# Altium project RecepteurTelecommande.PrjPcb
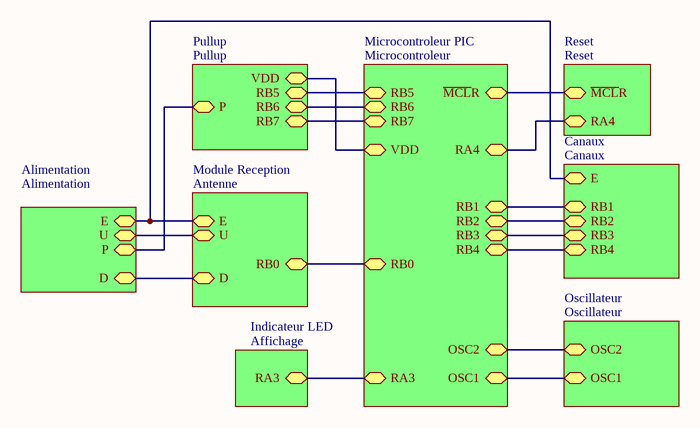
[diagram p0: Recepteur.SchDoc]
9 sheets, 36 parts. Net scope: hierarchical (ports join the sheet entries above them; power ports are global).
Board file: Recepteur.PcbDoc
Sheets:
  Recepteur.SchDoc
    Canaux = Canaux.SchDoc
    Reset = Reset.SchDoc
    Oscillateur = Oscillateur.SchDoc
    Alimentation = Alimentation.SchDoc
    Module Reception = Antenne.SchDoc
    Indicateur LED = Affichage.SchDoc
    Microcontroleur PIC = Microcontroleur.SchDoc
    Pullup = Pullup.SchDoc

## Sheet Recepteur.SchDoc
size A4

### Sub-sheets
Alimentation = Alimentation: E, U, D, P
Canaux = Canaux: RB1, RB2, RB3, RB4, E
Indicateur LED = Affichage: RA3
Microcontroleur PIC = Microcontroleur: RB5, RB6, RB7, RB0, RA3, OSC1, OSC2, RB4, RB3, RB2, RB1, ~{MCL}R, VDD, RA4
Module Reception = Antenne: RB0, D, U, E
Oscillateur = Oscillateur: OSC2, OSC1
Pullup = Pullup: RB5, RB6, RB7, P, VDD
Reset = Reset: ~{MCL}R, RA4

### Nets
NetC1_1: sheet Reset/RA4, sheet Alimentation/U, sheet Alimentation/P, sheet Module Reception/U, sheet Microcontroleur PIC/VDD, sheet Microcontroleur PIC/RA4, sheet Pullup/P, sheet Pullup/VDD
NetC3_1: sheet Canaux/E, sheet Alimentation/E, sheet Module Reception/E
NetC4_2: sheet Oscillateur/OSC2, sheet Microcontroleur PIC/OSC2
NetC5_2: sheet Oscillateur/OSC1, sheet Microcontroleur PIC/OSC1
NetD2_1: sheet Alimentation/D, sheet Module Reception/RB0, sheet Module Reception/D, sheet Microcontroleur PIC/RB0
NetLD1_1: sheet Indicateur LED/RA3, sheet Microcontroleur PIC/RA3
NetR2_1: sheet Microcontroleur PIC/RB5, sheet Pullup/RB5
NetR3_1: sheet Microcontroleur PIC/RB6, sheet Pullup/RB6
NetR4_1: sheet Microcontroleur PIC/RB7, sheet Pullup/RB7
NetR7_2: sheet Reset/~{MCL}R, sheet Microcontroleur PIC/~{MCL}R
NetU3_7: sheet Canaux/RB1, sheet Microcontroleur PIC/RB1
NetU3_8: sheet Canaux/RB2, sheet Microcontroleur PIC/RB2
NetU3_9: sheet Canaux/RB3, sheet Microcontroleur PIC/RB3
NetU3_10: sheet Canaux/RB4, sheet Microcontroleur PIC/RB4

## Sheet Canaux.SchDoc
size A
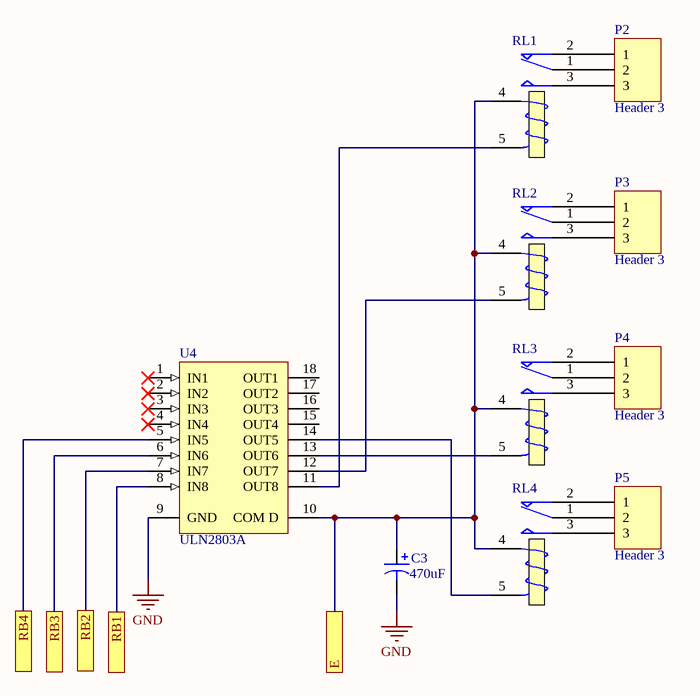
[diagram p1: Canaux.SchDoc]

### Parts
C3  value 470uF  [RB7.6-15]  (hidden comment: Cap Pol1)
P2  Header 3  [HDR1X3]
P3  Header 3  [HDR1X3]
P4  Header 3  [HDR1X3]
P5  Header 3  [HDR1X3]
RL1  Relay  [MODULE5B]  (value not drawn)
RL2  Relay  [MODULE5B]  (value not drawn)
RL3  Relay  [MODULE5B]  (value not drawn)
RL4  Relay  [MODULE5B]  (value not drawn)
U4  ULN2803A  [A18]

### Ports
E, RB1, RB2, RB3, RB4

### Nets
GND: C3.2 U4.9(GND)
NetC3_1: C3.1 RL1.4(T1) RL2.4(T1) RL3.4(T1) RL4.4(T1) U4.10(COM_D) ; port E
NetP2_1: P2.1 RL1.2(NC)
NetP2_2: P2.2 RL1.1(COM)
NetP2_3: P2.3 RL1.3(NO)
NetP3_1: P3.1 RL2.2(NC)
NetP3_2: P3.2 RL2.1(COM)
NetP3_3: P3.3 RL2.3(NO)
NetP4_1: P4.1 RL3.2(NC)
NetP4_2: P4.2 RL3.1(COM)
NetP4_3: P4.3 RL3.3(NO)
NetP5_1: P5.1 RL4.2(NC)
NetP5_2: P5.2 RL4.1(COM)
NetP5_3: P5.3 RL4.3(NO)
NetRL1_5: RL1.5(T2) U4.11(OUT8)
NetRL2_5: RL2.5(T2) U4.12(OUT7)
NetRL3_5: RL3.5(T2) U4.13(OUT6)
NetRL4_5: RL4.5(T2) U4.14(OUT5)
NetU3_7: U4.8(IN8) ; port RB1
NetU3_8: U4.7(IN7) ; port RB2
NetU3_9: U4.6(IN6) ; port RB3
NetU3_10: U4.5(IN5) ; port RB4

Not connected (* = marked no-connect by the designer): U4 1(IN1)* 2(IN2)* 3(IN3)* 4(IN4)* 15(OUT4) 16(OUT3) 17(OUT2) 18(OUT1)

### Library data of the parts
C3 = Cap Pol1: Polarized Capacitor (Radial); Published: 8-Jun-2000; LatestRevisionDate: 17-Jul-2002; LatestRevisionNote: Re-released for DXP Platform.; PackageReference: RB7.6-15; Publisher: Altium Limited; PackageDescription: Polarized Capacitor (Radial); 2 Leads
P2-P5 = Header 3: Header, 3-Pin; LatestRevisionDate: 17-Jul-2002; LatestRevisionNote: Re-released for DXP Platform.; Publisher: Altium Limited
RL1-RL4 = Relay: SPDT Relay; Published: 8-Jun-2000; LatestRevisionDate: 17-Jul-2002; LatestRevisionNote: Re-released for DXP Platform.; PackageReference: MODULE5B; Publisher: Altium Limited
U4 = ULN2803A: High-Voltage, High-Current Darlington Array; Published: 13-Oct-2000; LatestRevisionDate: 06-Jun-2005; LatestRevisionNote: Stylized 3D Model Added.; DatasheetVersion: 1999; PackageVersion: 1999; PackageReference: A18; Publisher: Altium Limited; PackageDescription: DIP; 18 Leads; Row Spacing 7.62 mm; Pitch 2.54 mm; ComponentLink1Description: Manufacturer Link; ComponentLink1URL: http://www.allegromicro.com/

## Sheet Reset.SchDoc
size A4
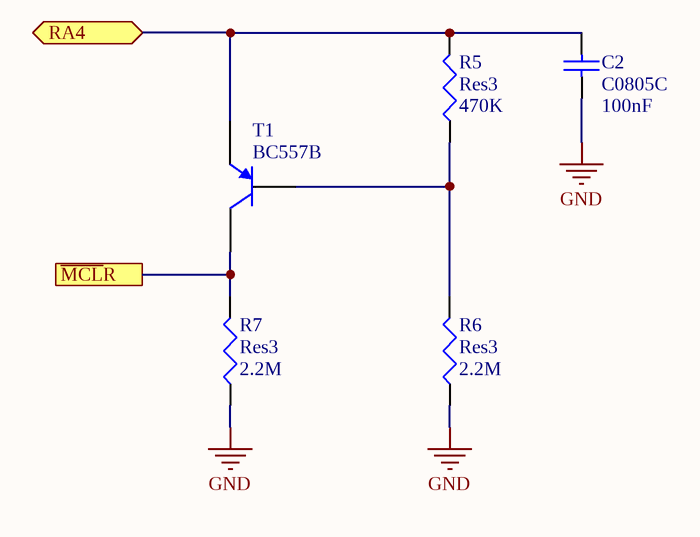
[diagram p2: Reset.SchDoc]

### Parts
C2  C0805C  value 100nF  [0805]
R5  Res3  value 470K  [J1-0603]
R6  Res3  value 2.2M  [J1-0603]
R7  Res3  value 2.2M  [J1-0603]
T1  BC557B  [29-04]

### Ports
RA4, ~{MCL}R

### Nets
GND: C2.1 R6.1 R7.1
NetC1_1: C2.2 R5.2 T1.3(E) ; port RA4
NetR5_1: R5.1 R6.2 T1.2(B)
NetR7_2: R7.2 T1.1(C) ; port ~{MCL}R

### Library data of the parts
C2 = C0805: Ceramic Chip Capacitor - Standard; Note: Footprint corresponds to dimensions for bulk cassette packaging. This case size has tightened tolerances.; Published: 17-Jul-2002; LatestRevisionDate: 19-Mar-2004; LatestRevisionNote: Silkscreen size reduced.; DatasheetDocument: Mar-2001; PackageDocument: Mar-2001; PackageReference: 0805; Publisher: Altium Limited; Code_JEITA: 0805; Code_IPC: 2012[0805]; ComponentLink1Description: Manufacturer Link; ComponentLink1URL: http://www.kemet.com/; ComponentLink2Description: Datasheet; ComponentLink2URL: http://www.kemet.com/kemet/web/homepage/kechome.nsf/vapubfilesname/F3102TA.pdf/$file/F3102TA.pdf
R5-R7 = Res3: Resistor; Published: 8-Jun-2000; LatestRevisionDate: 29-May-2009; LatestRevisionNote: IPC-7351 Footprint Added.; PackageReference: J1-0603; Publisher: Altium Limited; PackageDescription: Chip Resistor
T1 = BC557B: Amplifier Transistor PNP Silicon; Published: 29-Sep-2000; LatestRevisionDate: 17-Jul-2002; LatestRevisionNote: Re-released for DXP Platform.; DatasheetVersion: 1991; PackageVersion: 1996; PackageReference: 29-04; Publisher: Altium Limited; PackageDescription: TO, Flat Index; 3 In-Line, Axial Leads; Body Dia. 4.8mm; Leads 0.48 x 0.5 mm (max); ComponentLink1Description: Manufacturer Link; ComponentLink1URL: http://www.onsemi.com/site/products/landing?taxonomyID=194; ComponentLink2Description: Datasheet; ComponentLink2URL: http://www.onsemi.com/pub/Collateral/BC556B-D.PDF

## Sheet Oscillateur.SchDoc
size A
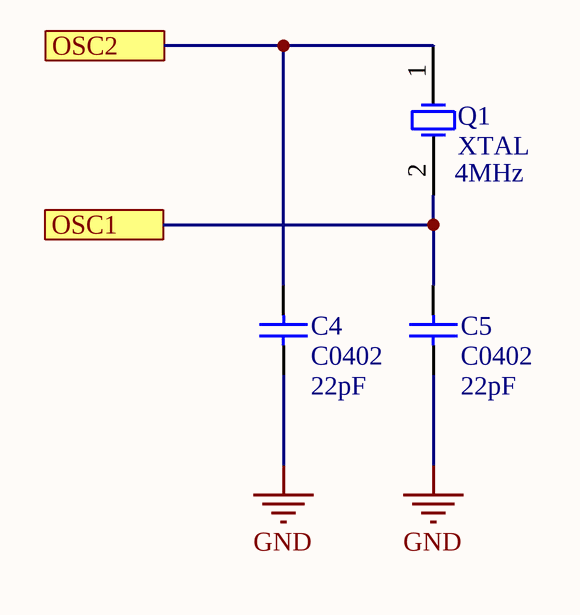
[diagram p3: Oscillateur.SchDoc]

### Parts
C4  C0402  value 22pF  [0402]
C5  C0402  value 22pF  [0402]
Q1  XTAL  value 4MHz  [R38]

### Ports
OSC1, OSC2

### Nets
GND: C4.1 C5.1
NetC4_2: C4.2 Q1.1(OSC1) ; port OSC2
NetC5_2: C5.2 Q1.2(OSC2) ; port OSC1

### Library data of the parts
C4 C5 = C0402: Ceramic Chip Capacitor - Standard; Note: Footprint corresponds to dimensions for bulk cassette packaging. This case size has tightened tolerances.; Published: 17-Jul-2002; LatestRevisionDate: 19-Mar-2004; LatestRevisionNote: Silkscreen size reduced.; DatasheetDocument: Mar-2001; PackageDocument: Mar-2001; PackageReference: 0402; Publisher: Altium Limited; Code_JEITA: 0402; Code_IPC: 1005 [0402]; ComponentLink1Description: Manufacturer Link; ComponentLink1URL: http://www.kemet.com/; ComponentLink2Description: Datasheet; ComponentLink2URL: http://www.kemet.com/kemet/web/homepage/kechome.nsf/vapubfilesname/F3102TA.pdf/$file/F3102TA.pdf
Q1 = XTAL: Crystal Oscillator; Published: 8-Jun-2000; LatestRevisionDate: 17-Jul-2002; LatestRevisionNote: Re-released for DXP Platform.; PackageReference: R38; Publisher: Altium Limited; PackageDescription: Crystal, Thru-Hole; 2 Leads; Body 3.1 x 8.2 mm (Dia.xH)

## Sheet Alimentation.SchDoc
size A
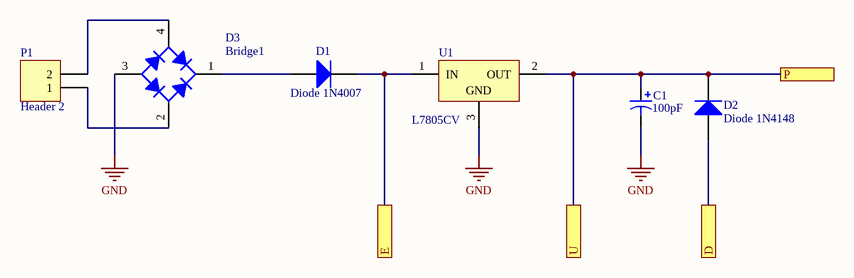
[diagram p4: Alimentation.SchDoc]

### Parts
C1  value 100pF  [RB7.6-15]  (hidden comment: Cap Pol1)
D1  Diode 1N4007  [DO-41]
D2  Diode 1N4148  [DO-35]
D3  Bridge1  [D-38]
P1  Header 2  [HDR1X2]
U1  L7805CV  [TO220ABN]

### Ports
D, E, P, U

### Nets
GND: C1.2 D3.3(A) U1.3(GND)
NetC1_1: C1.1 D2.2(K) U1.2(OUT) ; port U, port P
NetC3_1: D1.2(K) U1.1(IN) ; port E
NetD1_1: D1.1(A) D3.1(K)
NetD2_1: D2.1(A) ; port D
NetD3_2: D3.2(C) P1.1
NetD3_4: D3.4(C) P1.2

### Library data of the parts
C1 = Cap Pol1: Polarized Capacitor (Radial); Published: 8-Jun-2000; LatestRevisionDate: 17-Jul-2002; LatestRevisionNote: Re-released for DXP Platform.; PackageReference: RB7.6-15; Publisher: Altium Limited; PackageDescription: Polarized Capacitor (Radial); 2 Leads
D1 = Diode 1N4007: 1 Amp General Purpose Rectifier; Published: 8-Jun-2000; LatestRevisionDate: 17-Jul-2002; LatestRevisionNote: Re-released for DXP Platform.; DatasheetVersion: 1998; PackageVersion: Aug-1999; PackageReference: DO-41; Publisher: Altium Limited; PackageDescription: Diode, Axial; Body 5.2 x 2.7 mm (LxDia. max), Lead Dia. 0.86 mm (max); Code_JEDEC: DO-204-AL; ComponentLink1Description: Manufacturer Link; ComponentLink1URL: http://www.fairchildsemi.com/; ComponentLink2Description: Datasheet; ComponentLink2URL: http://www.fairchildsemi.com/ds/1N%2F1N4001.pdf
D2 = Diode 1N4148: High Conductance Fast Diode; Published: 8-Jun-2000; LatestRevisionDate: 17-Jul-2002; LatestRevisionNote: Re-released for DXP Platform.; DatasheetVersion: 1997; PackageReference: DO-35; Publisher: Altium Limited; PackageDescription: Diode, Axial; Body 3.8 x 1.9 mm (LxDia. max), Lead Dia. 0.53 mm (max); Code_JEDEC: DO-204-AH; ComponentLink1Description: Manufacturer Link; ComponentLink1URL: http://www.fairchildsemi.com/; ComponentLink2Description: Datasheet; ComponentLink2URL: http://www.fairchildsemi.com/ds/1N%2F1N4148.pdf
D3 = Bridge1: Full Wave Diode Bridge; Published: 8-Jun-2000; LatestRevisionDate: 29-May-2009; LatestRevisionNote: Sch pins A & K swapped.; DatasheetVersion: E2732B; PackageReference: D-38; Publisher: Altium Limited; PackageDescription: Bridge Rectifier; 4 Terminals; Body 9.4 x 9.4 mm (typ); Pitch 5.08 mm
P1 = Header 2: Header, 2-Pin; LatestRevisionDate: 17-Jul-2002; LatestRevisionNote: Re-released for DXP Platform.; Publisher: Altium Limited
U1 = L7805CV: Positive Voltage Regulator; Note: Tab is connected to pin 3 (GND).; Published: 24-Aug-2001; LatestRevisionDate: 17-Jul-2002; LatestRevisionNote: Re-released for DXP Platform.; DatasheetVersion: Dec-1998; PackageVersion: Jun-1998; PackageReference: TO220ABN; Publisher: Altium Limited; PackageDescription: TO, Thru-Hole, Vertical, Heatsink Mounted; 3 In-Line Leads; Pitch 2.54 mm; Pin sequence 1, 3, 2; ComponentLink1Description: Manufacturer Link; ComponentLink1URL: http://www.st.com/

## Sheet Antenne.SchDoc
size A
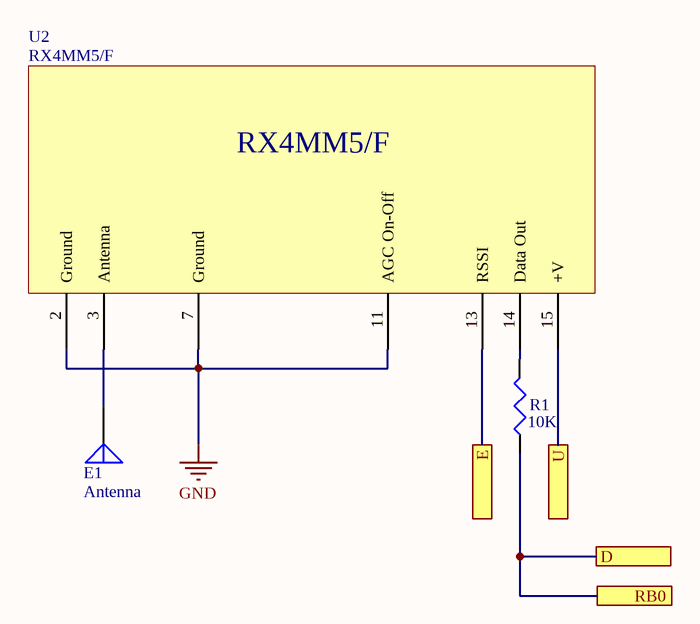
[diagram p5: Antenne.SchDoc]

### Parts
E1  Antenna  [PIN1]
R1  value 10K  [J1-0603]  (hidden comment: Res3)
U2  RX4MM5/F  [RX4MM5/F]

### Ports
D, E, RB0, U

### Nets
GND: U2.2(Ground) U2.7(Ground) U2.11(AGC_On-Off)
NetC1_1: U2.15(+V) ; port U
NetC3_1: U2.13(RSSI) ; port E
NetD2_1: R1.1 ; port RB0, port D
NetE1_1: E1.1(A) U2.3(Antenna)
NetR1_2: R1.2 U2.14(Data_Out)

### Library data of the parts
E1 = Antenna: Generic Antenna; Published: 24-Mar-1999; LatestRevisionDate: 17-Jul-2002; LatestRevisionNote: Re-released for DXP Platform.; PackageReference: PIN1; Publisher: Altium Limited
R1 = Res3: Resistor; Published: 8-Jun-2000; LatestRevisionDate: 29-May-2009; LatestRevisionNote: IPC-7351 Footprint Added.; PackageReference: J1-0603; Publisher: Altium Limited; PackageDescription: Chip Resistor
U2 = RX4MM5/F: RF Signal Receiver; LatestRevisionDate: 25-Oct-2012; DatasheetVersion: 2012; PackageReference: TO-92A; Publisher: FJ Custom; ComponentLink1Description: Manufacturer Link; ComponentLink1URL: https://www.aurelwireless.com/; ComponentLink2Description: Datasheet

## Sheet Affichage.SchDoc
size A
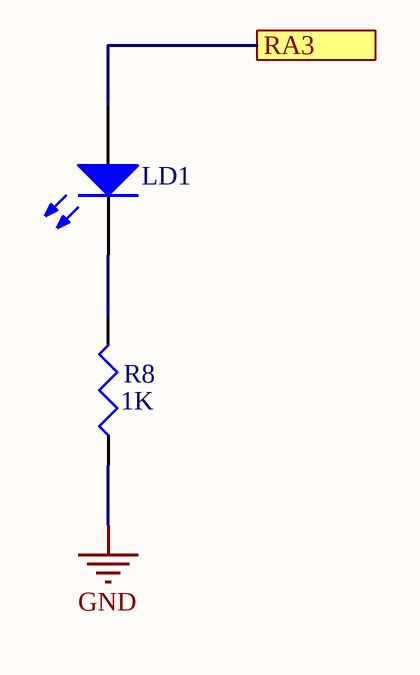
[diagram p6: Affichage.SchDoc]

### Parts
LD1  LED2  [3.2X1.6X1.1]  (value not drawn)
R8  value 1K  [J1-0603]  (hidden comment: Res3)

### Ports
RA3

### Nets
GND: R8.1
NetLD1_1: LD1.1(A) ; port RA3
NetLD1_2: LD1.2(K) R8.2

### Library data of the parts
LD1 = LED2: Typical RED, GREEN, YELLOW, AMBER GaAs LED; Published: 8-Jun-2000; LatestRevisionDate: 17-Jul-2002; LatestRevisionNote: Re-released for DXP Platform.; PackageVersion: Feb-2002; PackageReference: 3.2X1.6X1.1; Publisher: Altium Limited; PackageDescription: SM LED; 2 Flat Leads
R8 = Res3: Resistor; Published: 8-Jun-2000; LatestRevisionDate: 29-May-2009; LatestRevisionNote: IPC-7351 Footprint Added.; PackageReference: J1-0603; Publisher: Altium Limited; PackageDescription: Chip Resistor

## Sheet Microcontroleur.SchDoc
size A
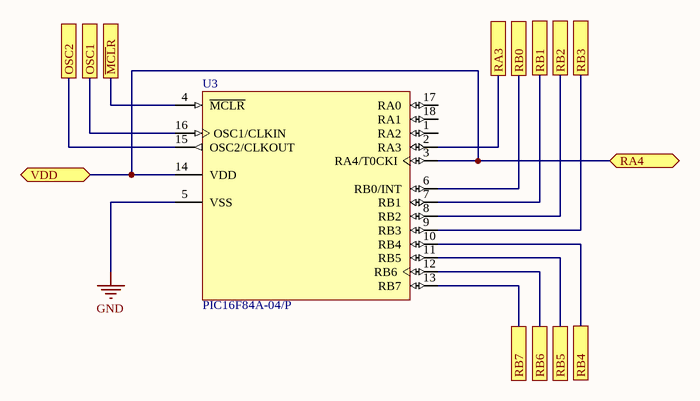
[diagram p7: Microcontroleur.SchDoc]

### Parts
U3  PIC16F84A-04/P  [PDIP300-P18]

### Ports
OSC1, OSC2, RA3, RA4, RB0, RB1, RB2, RB3, RB4, RB5, RB6, RB7, VDD, ~{MCL}R

### Nets
GND: U3.5(VSS)
NetC1_1: U3.3(RA4/T0CKI) U3.14(VDD) ; port VDD, port RA4
NetC4_2: U3.15(OSC2/CLKOUT) ; port OSC2
NetC5_2: U3.16(OSC1/CLKIN) ; port OSC1
NetD2_1: U3.6(RB0/INT) ; port RB0
NetLD1_1: U3.2(RA3) ; port RA3
NetR2_1: U3.11(RB5) ; port RB5
NetR3_1: U3.12(RB6) ; port RB6
NetR4_1: U3.13(RB7) ; port RB7
NetR7_2: U3.4(~{MCLR}) ; port ~{MCL}R
NetU3_7: U3.7(RB1) ; port RB1
NetU3_8: U3.8(RB2) ; port RB2
NetU3_9: U3.9(RB3) ; port RB3
NetU3_10: U3.10(RB4) ; port RB4

Not connected (* = marked no-connect by the designer): U3 1(RA2) 17(RA0) 18(RA1)

### Library data of the parts
U3 = PIC16F84A-04/P: Enhanced FLASH/EEPROM 8-Bit Microcontroller, 1K (x14-Bit words) FLASH, 68 Bytes RAM, 4 MHz, 18-Pin PDIP, Standard VDD Range, Commercial Temperature; Published: 11-Oct-2004; LatestRevisionDate: 29-Jan-2009; LatestRevisionNote: Sch. layout revised. 3D Model Removed.; DatasheetVersion: revB, Aug-2001; PackageVersion: revBB, Aug-2009; PackageReference: PDIP300-P18; Publisher: Altium Limited; PackageDescription: 18-Lead Plastic Dual In-Line (P) - 300 mil Body [PDIP]; Supplier 1: Digi-Key; Supplier Part Number 1: PIC16F84A-04/P-ND; Supplier 2: Farnell; Supplier Part Number 2: 1523947; Supplier 3: Farnell; Supplier Part Number 3: 9760865; Code_JEDEC: MS-001; ComponentLink1Description: Datasheet; ComponentLink1URL: http://ww1.microchip.com/downloads/en/DeviceDoc/35007b.pdf; ComponentLink2Description: Packaging Specification; ComponentLink2URL: http://www.microchip.com/stellent/groups/techpub_sg/documents/packagingspec/en012702.pdf; ComponentLink3Description: Microchip.com Home; ComponentLink3URL: http://www.microchip.com/

## Sheet Pullup.SchDoc
size A4
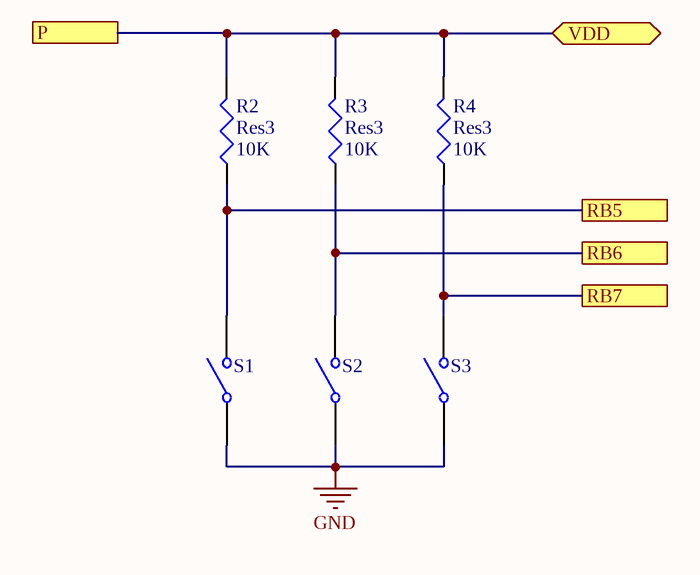
[diagram p8: Pullup.SchDoc]

### Parts
R2  Res3  value 10K  [J1-0603]
R3  Res3  value 10K  [J1-0603]
R4  Res3  value 10K  [J1-0603]
S1  SW-SPST  [SPST-2]  (value not drawn)
S2  SW-SPST  [SPST-2]  (value not drawn)
S3  SW-SPST  [SPST-2]  (value not drawn)

### Ports
P, RB5, RB6, RB7, VDD

### Nets
GND: S1.1(COMMON) S2.1(COMMON) S3.1(COMMON)
NetC1_1: R2.2 R3.2 R4.2 ; port P, port VDD
NetR2_1: R2.1 S1.2(NO) ; port RB5
NetR3_1: R3.1 S2.2(NO) ; port RB6
NetR4_1: R4.1 S3.2(NO) ; port RB7

### Library data of the parts
R2-R4 = Res3: Resistor; Published: 8-Jun-2000; LatestRevisionDate: 29-May-2009; LatestRevisionNote: IPC-7351 Footprint Added.; PackageReference: J1-0603; Publisher: Altium Limited; PackageDescription: Chip Resistor
S1-S3 = SW-SPST: Single-Pole, Single-Throw Switch; Published: 24-Mar-1999; LatestRevisionDate: 17-Jul-2002; LatestRevisionNote: Re-released for DXP Platform.; PackageReference: SPST-2; Publisher: Altium Limited; PackageDescription: Switch; 2 Leads

## Nets that join several sheets
GND: Canaux (C3.2 U4.9), Reset (C2.1 R6.1 R7.1), Oscillateur (C4.1 C5.1), Alimentation (C1.2 D3.3 U1.3), Antenne (U2.2 U2.7 U2.11), Affichage (R8.1), Microcontroleur (U3.5), Pullup (S1.1 S2.1 S3.1)
NetC1_1: Reset (C2.2 R5.2 T1.3), Alimentation (C1.1 D2.2 U1.2), Antenne (U2.15), Microcontroleur (U3.3 U3.14), Pullup (R2.2 R3.2 R4.2)
NetC3_1: Canaux (6 pins), Alimentation (D1.2 U1.1), Antenne (U2.13)
NetC4_2: Oscillateur (C4.2 Q1.1), Microcontroleur (U3.15)
NetC5_2: Oscillateur (C5.2 Q1.2), Microcontroleur (U3.16)
NetD2_1: Alimentation (D2.1), Antenne (R1.1), Microcontroleur (U3.6)
NetLD1_1: Affichage (LD1.1), Microcontroleur (U3.2)
NetR2_1: Microcontroleur (U3.11), Pullup (R2.1 S1.2)
NetR3_1: Microcontroleur (U3.12), Pullup (R3.1 S2.2)
NetR4_1: Microcontroleur (U3.13), Pullup (R4.1 S3.2)
NetR7_2: Reset (R7.2 T1.1), Microcontroleur (U3.4)
NetU3_7: Canaux (U4.8), Microcontroleur (U3.7)
NetU3_8: Canaux (U4.7), Microcontroleur (U3.8)
NetU3_9: Canaux (U4.6), Microcontroleur (U3.9)
NetU3_10: Canaux (U4.5), Microcontroleur (U3.10)